# Altium schematic sheet Actuators.SchDoc
size A; DocumentNumber: 5; SheetNumber: 5; SheetTotal: 5
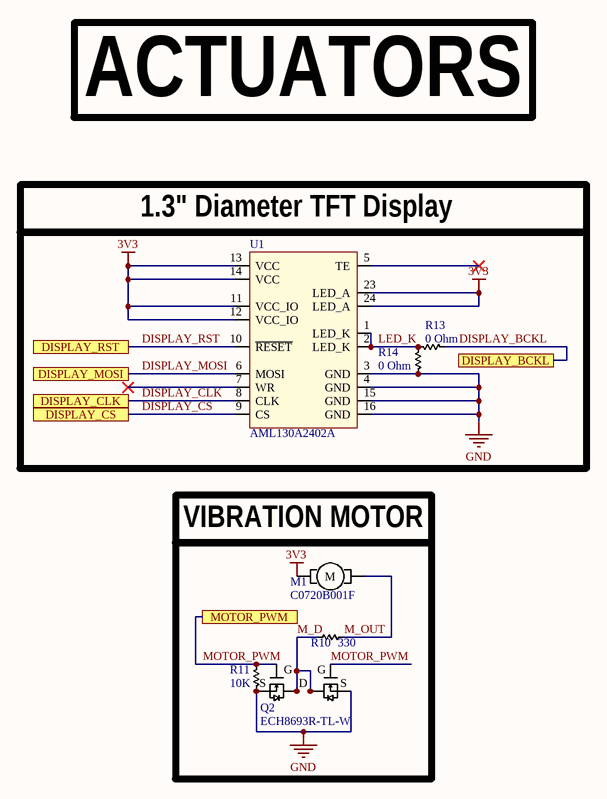
[diagram p0: Actuators.SchDoc]

## Parts
M1  C0720B001F  [C0720B001F]
Q2  ECH8693R-TL-W  [ECH8693R-TL-W]
R10  330  [RES_0603_HIGH]
R11  10K  [RES_0603_HIGH]
R13  0 Ohm  [RES_0603_HIGH]
R14  0 Ohm  [RES_0603_HIGH]  (no BOM)
U1  AML130A2402A  [AML130A2402A]

## Blocks framed on the sheet
1.3" Diameter TFT Display: R13 R14 U1
VIBRATION MOTOR: M1 Q2 R10 R11

## Ports
DISPLAY_BCKL, DISPLAY_CLK, DISPLAY_CS, DISPLAY_MOSI, DISPLAY_RST, MOTOR_PWM

## Nets
3V3: M1.1 U1.11(VCC_IO) U1.12(VCC_IO) U1.13(VCC) U1.14(VCC) U1.23(LED_A) U1.24(LED_A)
GND: Q2.1(S1) Q2.3(S2) R11.1 R14.2 U1.3(GND) U1.4(GND) U1.15(GND) U1.16(GND)
DISPLAY_BCKL: R13.1 ; port DISPLAY_BCKL
DISPLAY_CLK: U1.8(CLK) ; port DISPLAY_CLK
DISPLAY_CS: U1.9(CS) ; port DISPLAY_CS
DISPLAY_MOSI: U1.6(MOSI) ; port DISPLAY_MOSI
DISPLAY_RST: U1.10(~{RESET}) ; port DISPLAY_RST
LED_K: R13.2 R14.1 U1.1(LED_K) U1.2(LED_K)
M_D: Q2.5(D) Q2.6(D) Q2.7(D) Q2.8(D) R10.1
M_OUT: M1.2 R10.2
MOTOR_PWM: Q2.2(G1) Q2.4(G2) R11.2 ; port MOTOR_PWM

Not connected (* = marked no-connect by the designer): U1 5(TE)* 7(WR)*

## Notes on the sheet
- ACTUATORS
- (in symbol C0720B001F) M
- (in symbol ECH8693R-TL-W) G; S

## Library data of the parts
M1 = C0720B001F: DC Motor Vibration, ERM 10000 RPM 3VDC
Q2 = ECH8693R-TL-W: Mosfet Array 2 N-Channel (Dual) Common Drain 24V 14A 1.4W Surface Mount SOT-28FL/ECH8
R10 R11 R13 R14 = Resistor_0603: 0603 Resistor
U1 = AML130A2402A: AML130A2402A Round 1.3" TFT Display